# EasyEDA schematic moana-lf-robot.json
TITLE: Schematic for moana Line Following Robot; REV: 1.0; Date: 2024-06-18; Sheet: 1/1; Drawn By: Rodney Osodo; Company: 0x6flab
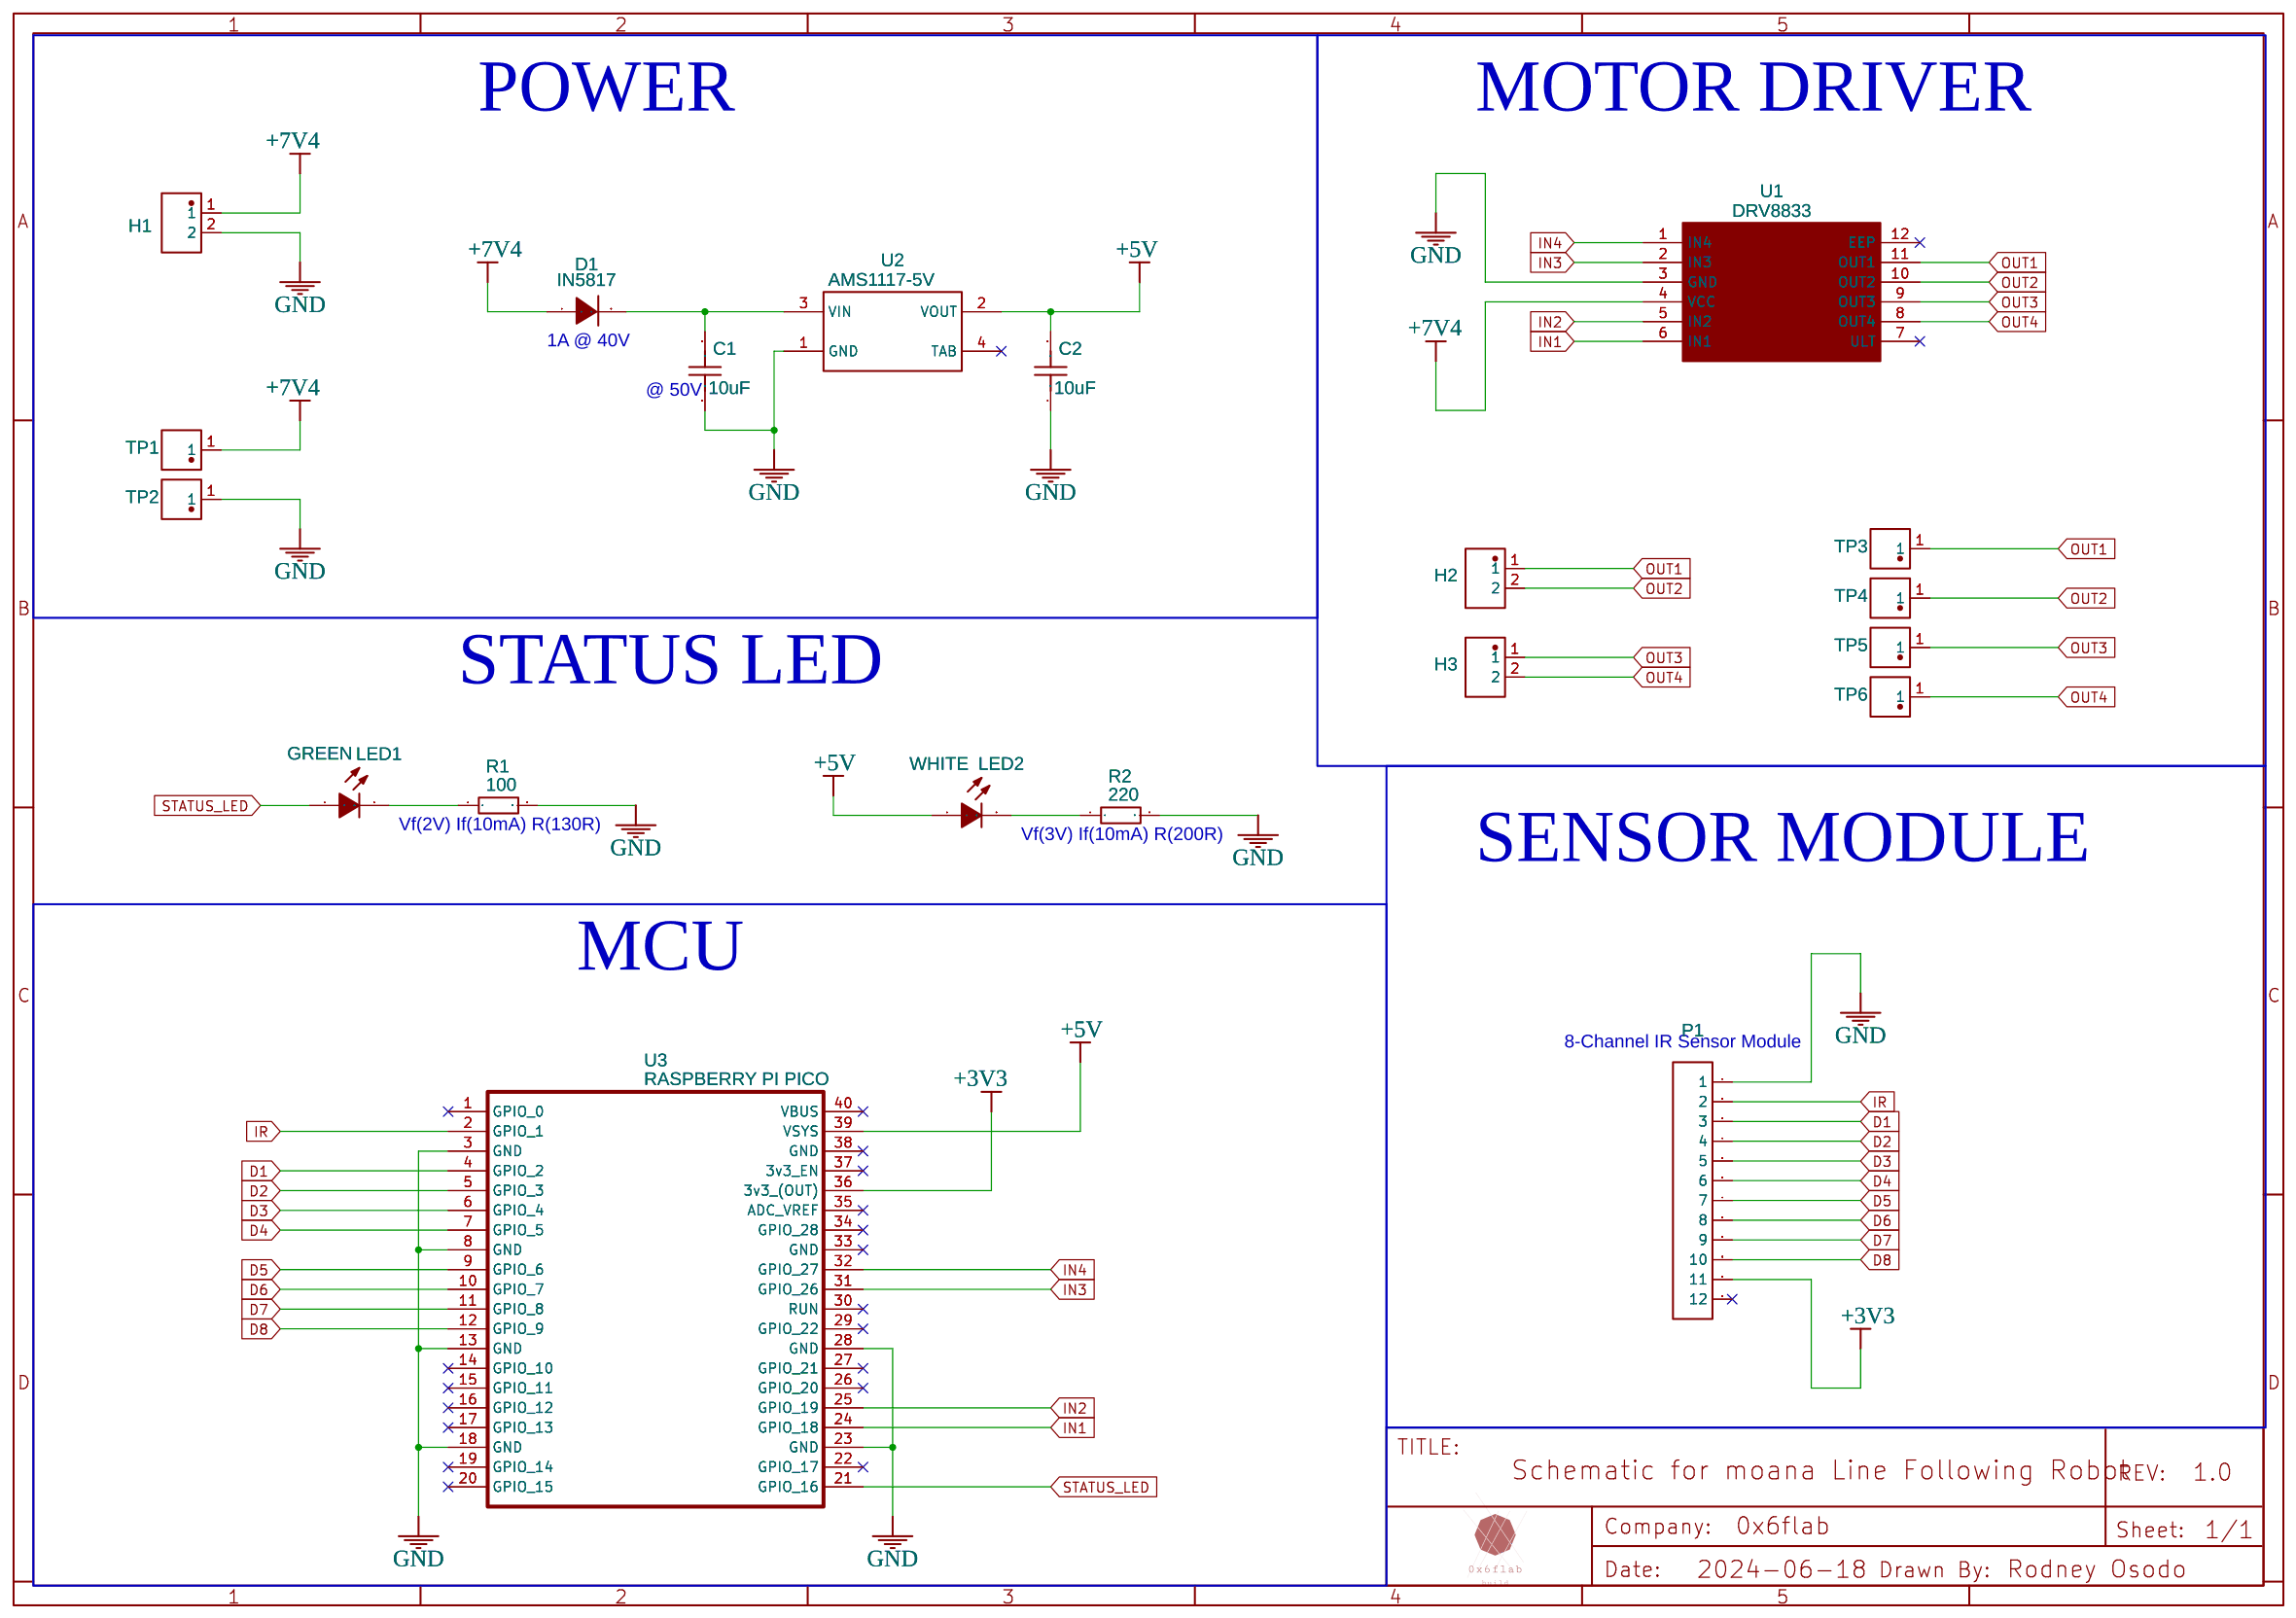
[diagram p0: schematic sheet]

## Parts
C1  10uF  [CAP-TH_L5.0-W2.5-P5.08-D0.7]
C2  10uF  [CAP-TH_L5.0-W2.5-P5.08-D0.7]
D1  IN5817  [IN5817 DO-41]
H1  210-91-02GB01  [HDR-TH_2P-P2.54-V-M-1]
H2  210-91-02GB01  [HDR-TH_2P-P2.54-V-M-1]
H3  210-91-02GB01  [HDR-TH_2P-P2.54-V-M-1]
LED1  GREEN  [LED-TH_BD4.0-P2.54-FD]
LED2  WHITE  [LED-TH_BD4.0-P2.54-FD]
P1  HEADER - 2.54MM 1X12  [12X2.54MM HEADER]
R1  100  [RES-TH_BD2.2-L6.5-P10.50-D0.6]
R2  220  [RES-TH_BD2.2-L6.5-P10.50-D0.6]
TP1  TP_SMD_2.5mm  [TESTPOINT-SMD_2.5MM]
TP2  TP_SMD_2.5mm  [TESTPOINT-SMD_2.5MM]
TP3  TP_SMD_2.5mm  [TESTPOINT-SMD_2.5MM]
TP4  TP_SMD_2.5mm  [TESTPOINT-SMD_2.5MM]
TP5  TP_SMD_2.5mm  [TESTPOINT-SMD_2.5MM]
TP6  TP_SMD_2.5mm  [TESTPOINT-SMD_2.5MM]
U1  DRV8833  [DRV8833 MOTOR DRIVER]
U2  AMS1117-5V  [SOT-223-4_L6.5-W3.5-P2.30-LS7.0-BR]
U3  RASPBERRY PI PICO  [RASPBERRY PI PICO/ RASPBERRY PI PICO W]

## Library data of the parts
C1 C2 = CC1H104ZC14D3F5O10MF: Contributor: LCSC; Supplier: LCSC; Supplier Part: C254090; Manufacturer: Dersonic(德尔创); JLCPCB Part Class: Extended Part
D1 = IN5817 SCHOTTKY DIODE: Supplier: Element14; Manufacturer Part: 1N5817; Manufacturer: STMicroelectronics; image: //image.lceda.cn/szlcsc/C84026.jpg; Supplier Part: C84026; Contributor: hafiz_8030
H1-H3 = 210-91-02GB01: Contributor: LCSC; Supplier: LCSC; Supplier Part: C390678; Manufacturer: PINREX(频锐科技); JLCPCB Part Class: Extended Part
LED1 LED2 = 204-10SUBC/C470/S400-A4: Contributor: LCSC; Supplier: LCSC; Supplier Part: C86726; Manufacturer: EVERLIGHT(亿光); JLCPCB Part Class: Extended Part
P1 = HEADER - 2.54MM 1X12: Supplier: Mouser; Manufacturer: ReliaPro; Manufacturer Part: 2.54_1x12; Supplier Part: C124413; Contributor: sterno208
R1 R2 = MF1/4W-1Ω±1% T52: Supplier: LCSC; Supplier Part: C119263; Manufacturer: Chian Chia Elec; Contributor: LCSC; JLCPCB Part Class: Extended Part; Resistance: 1Ω
TP1-TP6 = TP_SMD_2.5mm: Supplier: LCSC; Supplier Part: C9900021701; Manufacturer: null; Manufacturer Part: 15X5焊片; JLCPCB Part Class: Extended Part; Contributor: kiran_1984
U1 = DRV8833: sourceId: YsmgyP7pj
U2 = AMS1117-5V: Supplier Part: C2688239; Manufacturer: WPMtek(维攀微); Contributor: Sv En; JLCPCB Part Class: Extended Part
U3 = RASPBERRY PI PICO: Contributor: Laurent Gorlier

## Nets
+3V3: P1.11 U3.36(3v3 (OUT))
+5V: C2.2 LED2.1(A) U2.2(VOUT) U3.39(VSYS)
+7V4: D1.1(A) H1.1 TP1.1 U1.4(VCC)
GND: C1.1 C2.1 H1.2 P1.1 R1.2 R2.2 TP2.1 U1.3(GND) U2.1(GND) U3.3(GND) U3.8(GND) U3.13(GND) U3.18(GND) U3.23(GND) U3.28(GND)
D1: P1.3 U3.4(GPIO 2)
D2: P1.4 U3.5(GPIO 3)
D3: P1.5 U3.6(GPIO 4)
D4: P1.6 U3.7(GPIO 5)
D5: P1.7 U3.9(GPIO 6)
D6: P1.8 U3.10(GPIO 7)
D7: P1.9 U3.11(GPIO 8)
D8: P1.10 U3.12(GPIO 9)
IN1: U1.6(IN1) U3.24(GPIO 18)
IN2: U1.5(IN2) U3.25(GPIO 19)
IN3: U1.2(IN3) U3.31(GPIO 26)
IN4: U1.1(IN4) U3.32(GPIO 27)
IR: P1.2 U3.2(GPIO 1)
OUT1: H2.1 TP3.1 U1.11(OUT1)
OUT2: H2.2 TP4.1 U1.10(OUT2)
OUT3: H3.1 TP5.1 U1.9(OUT3)
OUT4: H3.2 TP6.1 U1.8(OUT4)
STATUS_LED: LED1.1(A) U3.21(GPIO 16)
Net-(C1-2): C1.2 D1.2(K) U2.3(VIN)
Net-(LED1-2): LED1.2(C) R1.1
Net-(LED2-2): LED2.2(C) R2.1

Not connected (* = marked no-connect by the designer): P1 12*; U1 7(ULT)* 12(EEP)*; U2 4(TAB)*; U3 1(GPIO 0)* 14(GPIO 10)* 15(GPIO 11)* 16(GPIO 12)* 17(GPIO 13)* 19(GPIO 14)* 20(GPIO 15)* 22(GPIO 17)* 26(GPIO 20)* 27(GPIO 21)* 29(GPIO 22)* 30(RUN)* 33(GND)* 34(GPIO 28)* 35(ADC_VREF)* 37(3v3_EN)* 38(GND)* 40(VBUS)*

## Notes on the sheet
- POWER
- MOTOR DRIVER
- 1A @ 40V
- @ 50V
- STATUS LED
- Vf(2V) If(10mA) R(130R)
- Vf(3V) If(10mA) R(200R)
- SENSOR MODULE
- MCU
- 8-Channel IR Sensor Module
